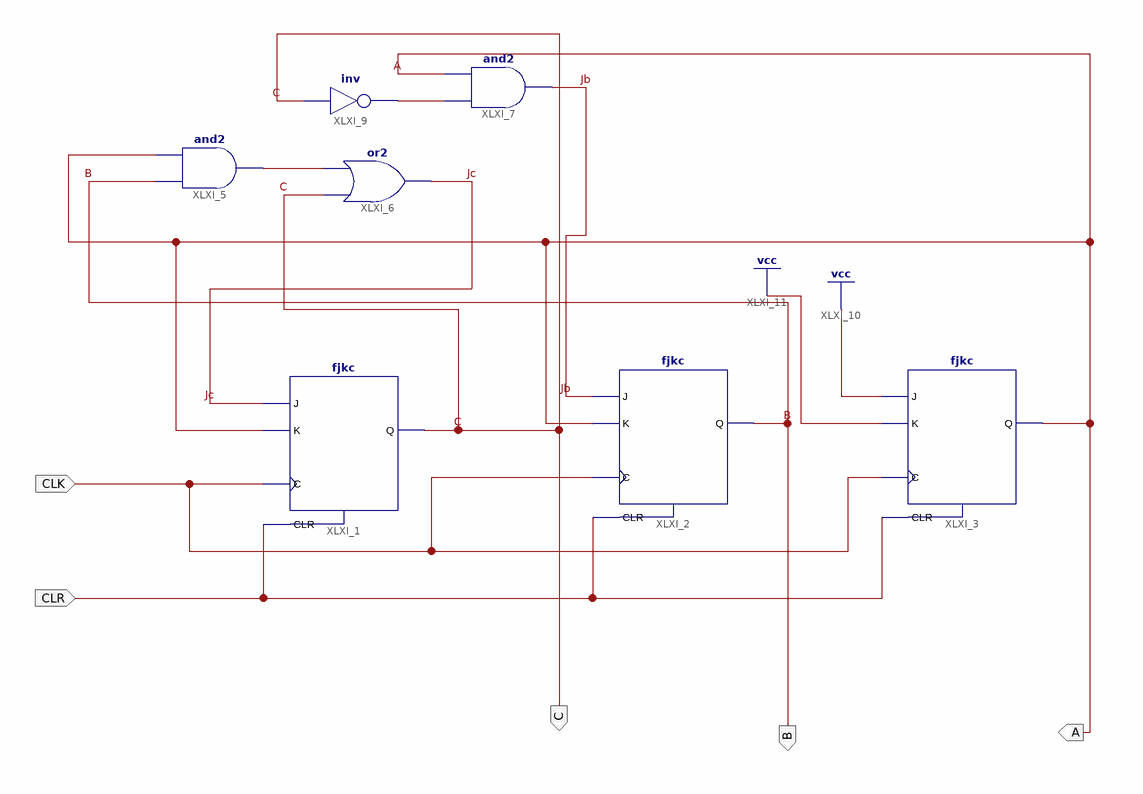
[diagram p0: schematic sheet 1]
// Xilinx ISE schematic counter05.sch (spartan6) as structural Verilog: 7 symbols, 5 ports
module counter05 (
  input  CLR,
  input  CLK,
  output C,
  output A,
  output B
);

  wire Jb, Jc, XLXN_9, XLXN_28;

  fjkc XLXI_2 (.C(CLK), .CLR(CLR), .J(Jb), .K(A), .Q(B));
  fjkc XLXI_3 (.C(CLK), .CLR(CLR), .J(1'b1), .K(1'b1), .Q(A));
  fjkc XLXI_1 (.C(CLK), .CLR(CLR), .J(Jc), .K(A), .Q(C));
  or XLXI_6 (Jc, C, XLXN_9);
  and XLXI_5 (XLXN_9, B, A);
  not XLXI_9 (XLXN_28, C);
  and XLXI_7 (Jb, XLXN_28, A);
endmodule
